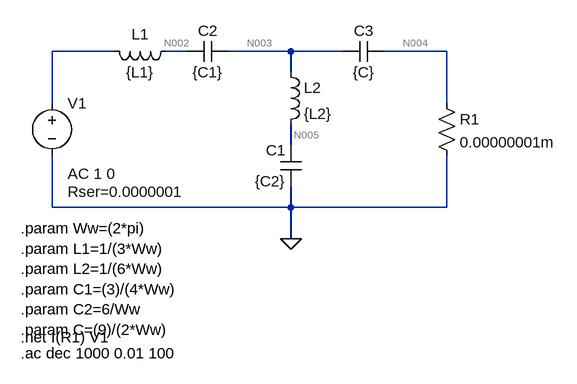
[diagram p0: schematic Ej1.asc]
Ej1.asc, the LTspice schematic file:
Version 4
SHEET 1 880 680
WIRE 16 96 -80 96
WIRE 128 96 96 96
WIRE 288 96 192 96
WIRE 368 96 288 96
WIRE 528 96 432 96
WIRE 288 128 288 96
WIRE -80 176 -80 96
WIRE 528 176 528 96
WIRE 288 240 288 208
WIRE -80 336 -80 256
WIRE 288 336 288 304
WIRE 288 336 -80 336
WIRE 528 336 528 256
WIRE 528 336 288 336
WIRE 288 384 288 336
FLAG 288 384 0
SYMBOL ind 112 80 R90
WINDOW 0 5 56 VBottom 2
WINDOW 3 32 56 VTop 2
SYMATTR InstName L1
SYMATTR Value {L1}
SYMATTR SpiceLine Rser=1m
SYMBOL cap 192 80 R90
WINDOW 0 0 32 VBottom 2
WINDOW 3 32 32 VTop 2
SYMATTR InstName C2
SYMATTR Value {C1}
SYMBOL cap 304 304 R180
WINDOW 0 24 56 Left 2
WINDOW 3 24 8 Left 2
SYMATTR InstName C1
SYMATTR Value {C2}
SYMBOL ind 272 112 R0
SYMATTR InstName L2
SYMATTR Value {L2}
SYMATTR SpiceLine Rser=1m
SYMBOL cap 432 80 R90
WINDOW 0 0 32 VBottom 2
WINDOW 3 32 32 VTop 2
SYMATTR InstName C3
SYMATTR Value {C}
SYMBOL res 512 160 R0
SYMATTR InstName R1
SYMATTR Value 0.00000001m
SYMBOL voltage -80 160 R0
WINDOW 123 24 124 Left 2
WINDOW 39 24 152 Left 2
SYMATTR InstName V1
SYMATTR Value ""
SYMATTR Value2 AC 1 0
SYMATTR SpiceLine Rser=0.0000001
TEXT -128 368 Left 2 !.param Ww=(2*pi)\n.param L1=1/(3*Ww)\n.param L2=1/(6*Ww)\n.param C1=(3)/(4*Ww) \n.param C2=6/Ww\n.param C=(9)/(2*Ww)
TEXT -128 536 Left 2 !.net I(R1) V1
TEXT -128 560 Left 2 !.ac dec 1000 0.01 100

The netlist it stands for:
* Ej1.asc
L1 N002 N001 {L1} Rser=1m
C2 N003 N002 {C1}
C1 0 N005 {C2}
L2 N003 N005 {L2} Rser=1m
C3 N004 N003 {C}
R1 N004 0 0.00000001m
V1 N001 0 AC 1 0 Rser=0.0000001
.param Ww=(2*pi)
.param L1=1/(3*Ww)
.param L2=1/(6*Ww)
.param C1=(3)/(4*Ww)
.param C2=6/Ww
.param C=(9)/(2*Ww)
.net I(R1) V1
.ac dec 1000 0.01 100
.backanno
.end

* Results of the author's LTspice run, read from the files saved beside the schematic
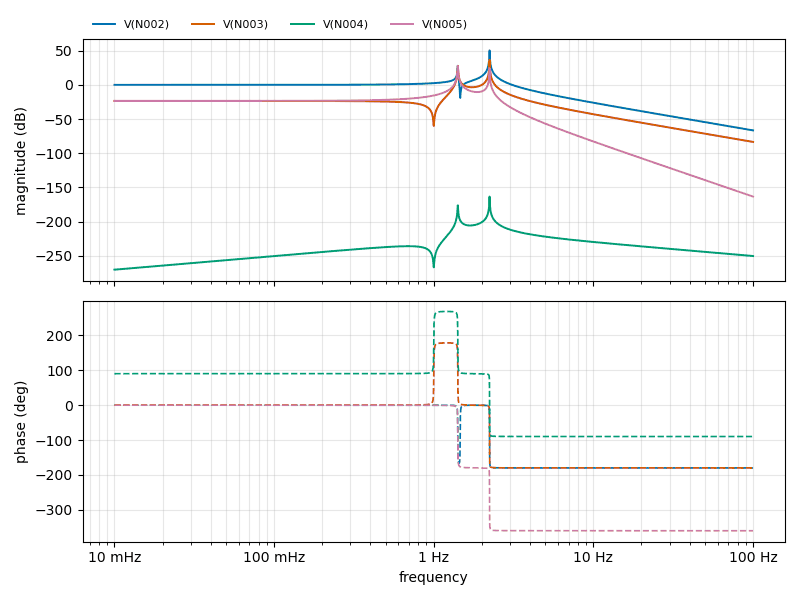
[diagram p1: AC Analysis of Ej1.asc, plotted from the saved traces]
* AC Analysis, 1 run:
*   V(N002): 0.00 dB at 10 mHz, -66.62 dB at 100 Hz, peak 50.41 dB at 2.234 Hz, 3 dB below the peak at 2.232 Hz and 2.24 Hz
*   V(N003): -23.52 dB at 10 mHz, -83.52 dB at 100 Hz, peak 36.44 dB at 2.234 Hz, 3 dB below the peak at 2.232 Hz and 2.24 Hz
*   V(N004): -270.46 dB at 10 mHz, -250.45 dB at 100 Hz, peak -163.52 dB at 2.234 Hz, 3 dB below the peak at 2.232 Hz and 2.24 Hz
*   V(N005): -23.52 dB at 10 mHz, -163.52 dB at 100 Hz, peak 27.69 dB at 1.416 Hz, 3 dB below the peak at 1.411 Hz and 1.418 Hz